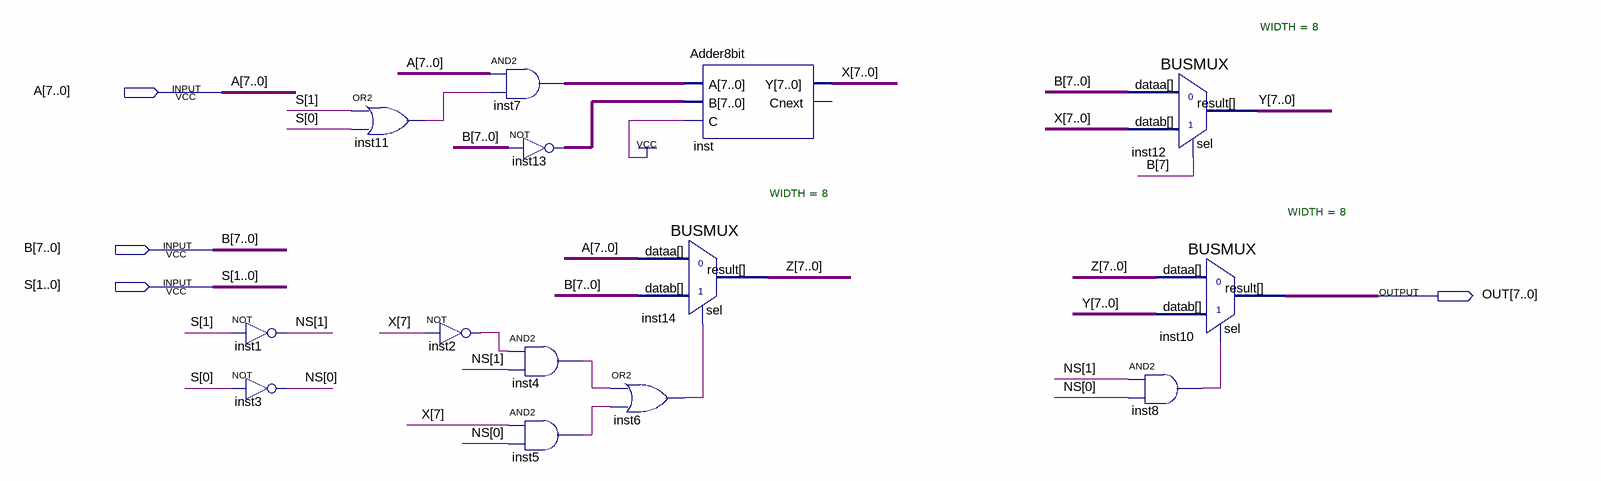
[diagram p0: schematic sheet]
// Quartus schematic AbsMinMax.bdf as structural Verilog: 14 symbols, 4 pins
module AbsMinMax (
  input  [7:0] A,
  input  [7:0] B,
  input  [1:0] S,
  output [7:0] OUT
);

  wire inst2_out, inst4_out, inst5_out, inst6_out, inst8_out, inst11_out;
  wire [1:0] NS;
  wire [7:0] inst7_out, inst13_out, X, Y, Z;

  not inst1 (NS[1], S[1]);
  not inst3 (NS[0], S[0]);
  or inst11 (inst11_out, S[1], S[0]);
  not inst2 (inst2_out, X[7]);
  assign inst7_out = A & {8{inst11_out}};  // AND2 inst7, 8 bits wide
  assign inst13_out = ~B;  // NOT inst13, 8 bits wide
  and inst4 (inst4_out, inst2_out, NS[1]);
  and inst5 (inst5_out, X[7], NS[0]);
  BUSMUX #(.WIDTH(8)) inst14 (.datab(B), .sel(inst6_out), .dataa(A), .result(Z));
  or inst6 (inst6_out, inst4_out, inst5_out);
  Adder8bit inst (.A(inst7_out), .B(inst13_out), .C(1'b1), .Y(X));  // open: Cnext
  BUSMUX #(.WIDTH(8)) inst12 (.datab(X), .sel(B[7]), .dataa(B), .result(Y));
  BUSMUX #(.WIDTH(8)) inst10 (.datab(Y), .sel(inst8_out), .dataa(Z), .result(OUT));
  and inst8 (inst8_out, NS[1], NS[0]);
endmodule
